# EAGLE schematic cleanup_test01 (EAGLE 7.2.0)
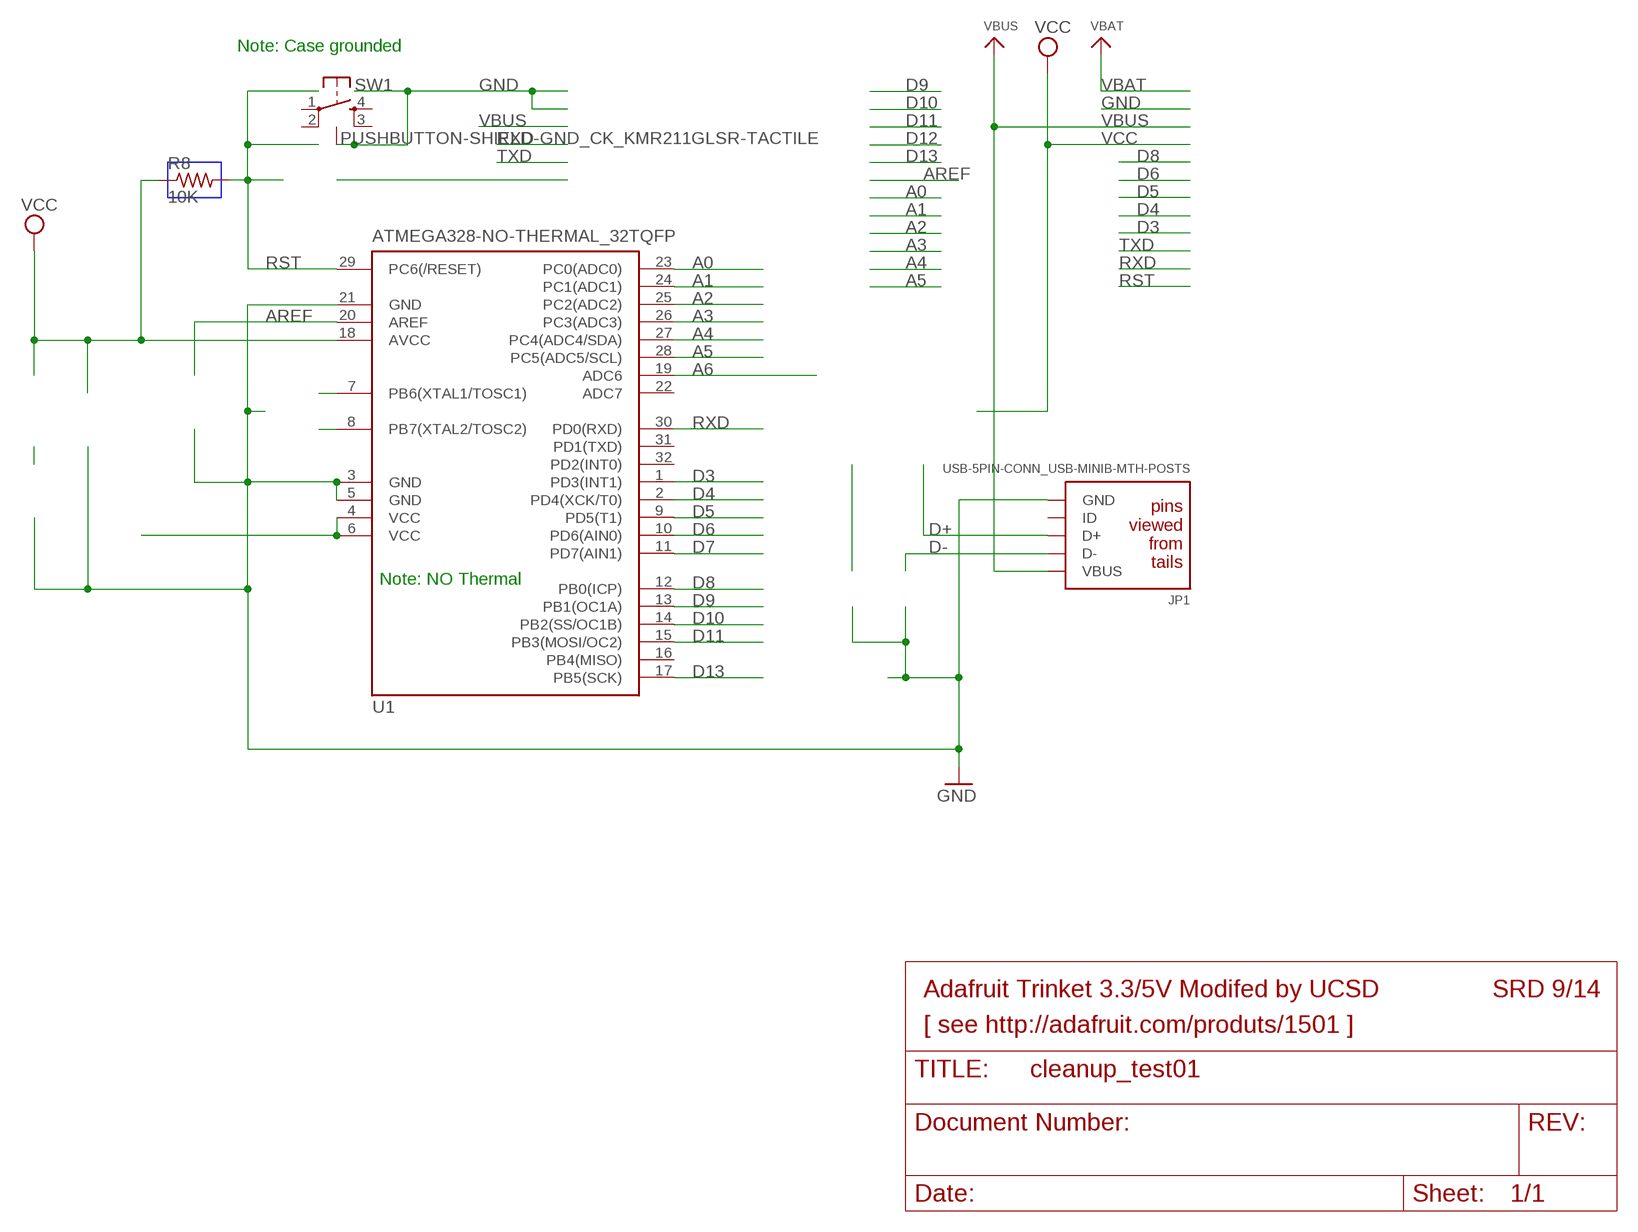
[diagram p0: schematic, sheet 1]

## Parts
JP1  USB-5PIN-CONN_USB-MINIB-MTH-POSTS  [FCI_10033526]
R8  10K  GENERIC-RESISTOR_  (no package)
SW1  PUSHBUTTON-SHIELD-GND_CK_KMR211GLSR-TACTILE  [CK_KMR211GLSR]
U1  ATMEGA328-NO-THERMAL_32TQFP  [QFP80P900X900X120-32L30HS]

## Nets
A0: U1.23(PC0(ADC0))
A1: U1.24(PC1(ADC1))
A2: U1.25(PC2(ADC2))
A3: U1.26(PC3(ADC3))
A4: U1.27(PC4(ADC4/SDA))
A5: U1.28(PC5(ADC5/SCL))
A6: U1.19(ADC6)
AREF: U1.20(AREF)
D3: U1.1(PD3(INT1))
D4: U1.2(PD4(XCK/T0))
D5: U1.9(PD5(T1))
D6: U1.10(PD6(AIN0))
D7: U1.11(PD7(AIN1))
D8: U1.12(PB0(ICP))
D9: U1.13(PB1(OC1A))
D10: U1.14(PB2(SS/OC1B))
D11: U1.15(PB3(MOSI/OC2))
D13: U1.17(PB5(SCK))
D+: JP1.3(D+)
D-: JP1.2(D-)
GND: JP1.5(GND) SW1.1 SW1.4 SW1.5 U1.3(GND) U1.5(GND) U1.21(GND)
N$1: U1.4(VCC) U1.6(VCC)
N$4: U1.8(PB7(XTAL2/TOSC2))
N$5: U1.7(PB6(XTAL1/TOSC1))
RST: R8.2 SW1.2 SW1.3 U1.29(PC6(/RESET))
RXD: U1.30(PD0(RXD))
VBUS: JP1.1(VBUS)
VCC: R8.1 U1.18(AVCC)
Unconnected: JP1.4(ID) U1.16(PB4(MISO)) U1.22(ADC7) U1.31(PD1(TXD)) U1.32(PD2(INT0))

## Notes on the sheet
- Note: Case grounded
- Note: NO Thermal
- Adafruit Trinket 3.3/5V Modifed by UCSD | SRD 9/14
- [ see http://adafruit.com/produts/1501 ]

## Library data of the parts
JP1 = NVSL:USB-5PIN-CONN_; DIST1: DigiKey; DIST1PN: 609-4701-1-ND; MFR: FCI; MPN: 10033526-N3212MLF
R8 = KoalaDesign:GENERIC-RESISTOR_
SW1 = NVSL:PUSHBUTTON-SHIELD-GND_; DIST1: DigiKey; DIST1PN: 401-1426-1-ND; MFR: C&K; MPN: KMR211GLFS
U1 = NVSL:ATMEGA328-NO-THERMAL_; DIST1: DigiKey; DIST1PN: ATMEGA328-AU-ND; MFR: Atmel; MPN: ATMEGA328-AU

## Net classes
1 power: width 0.305 mm